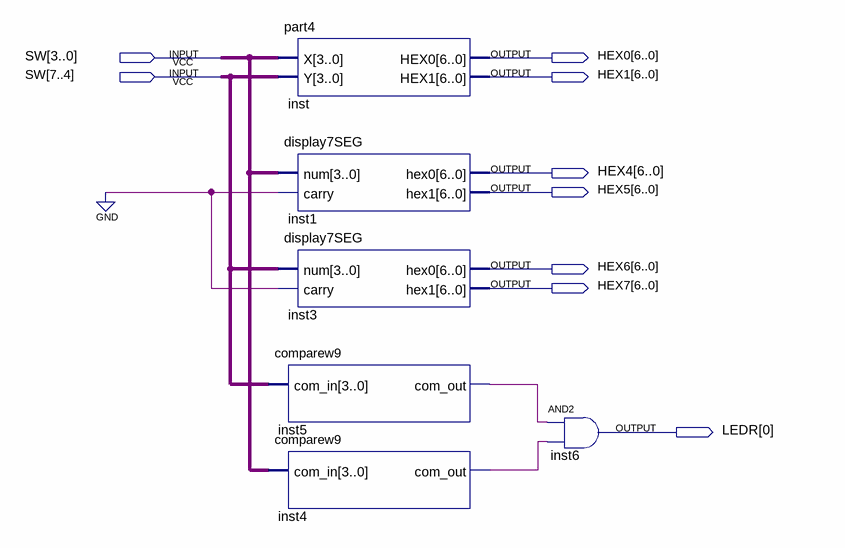
[diagram p0: schematic sheet]
// Quartus schematic part4_diagram.bdf as structural Verilog: 6 symbols, 9 pins
module part4_diagram (
  input  [7:0] SW,
  output [6:0] HEX0,
  output [6:0] HEX1,
  output [6:0] HEX4,
  output [6:0] HEX5,
  output [6:0] HEX6,
  output [6:0] HEX7,
  output [0:0] LEDR
);

  wire inst4_com_out, inst5_com_out;

  part4 inst (.X(SW[3:0]), .Y(SW[7:4]), .HEX0(HEX0), .HEX1(HEX1));
  display7SEG inst1 (.num(SW[3:0]), .carry(1'b0), .hex0(HEX4), .hex1(HEX5));
  display7SEG inst3 (.num(SW[7:4]), .carry(1'b0), .hex0(HEX6), .hex1(HEX7));
  comparew9 inst5 (.com_in(SW[7:4]), .com_out(inst5_com_out));
  comparew9 inst4 (.com_in(SW[3:0]), .com_out(inst4_com_out));
  // AND2 inst6 has open pins: IN1=inst5_com_out, IN2=inst4_com_out, OUT=open
endmodule
